# EAGLE design lyre_v1 (EAGLE 9.6.2)
CNAME: Parrot Teensy Board; CREVISION: 1.0; DESIGNER: Nathan Villicana-Shaw
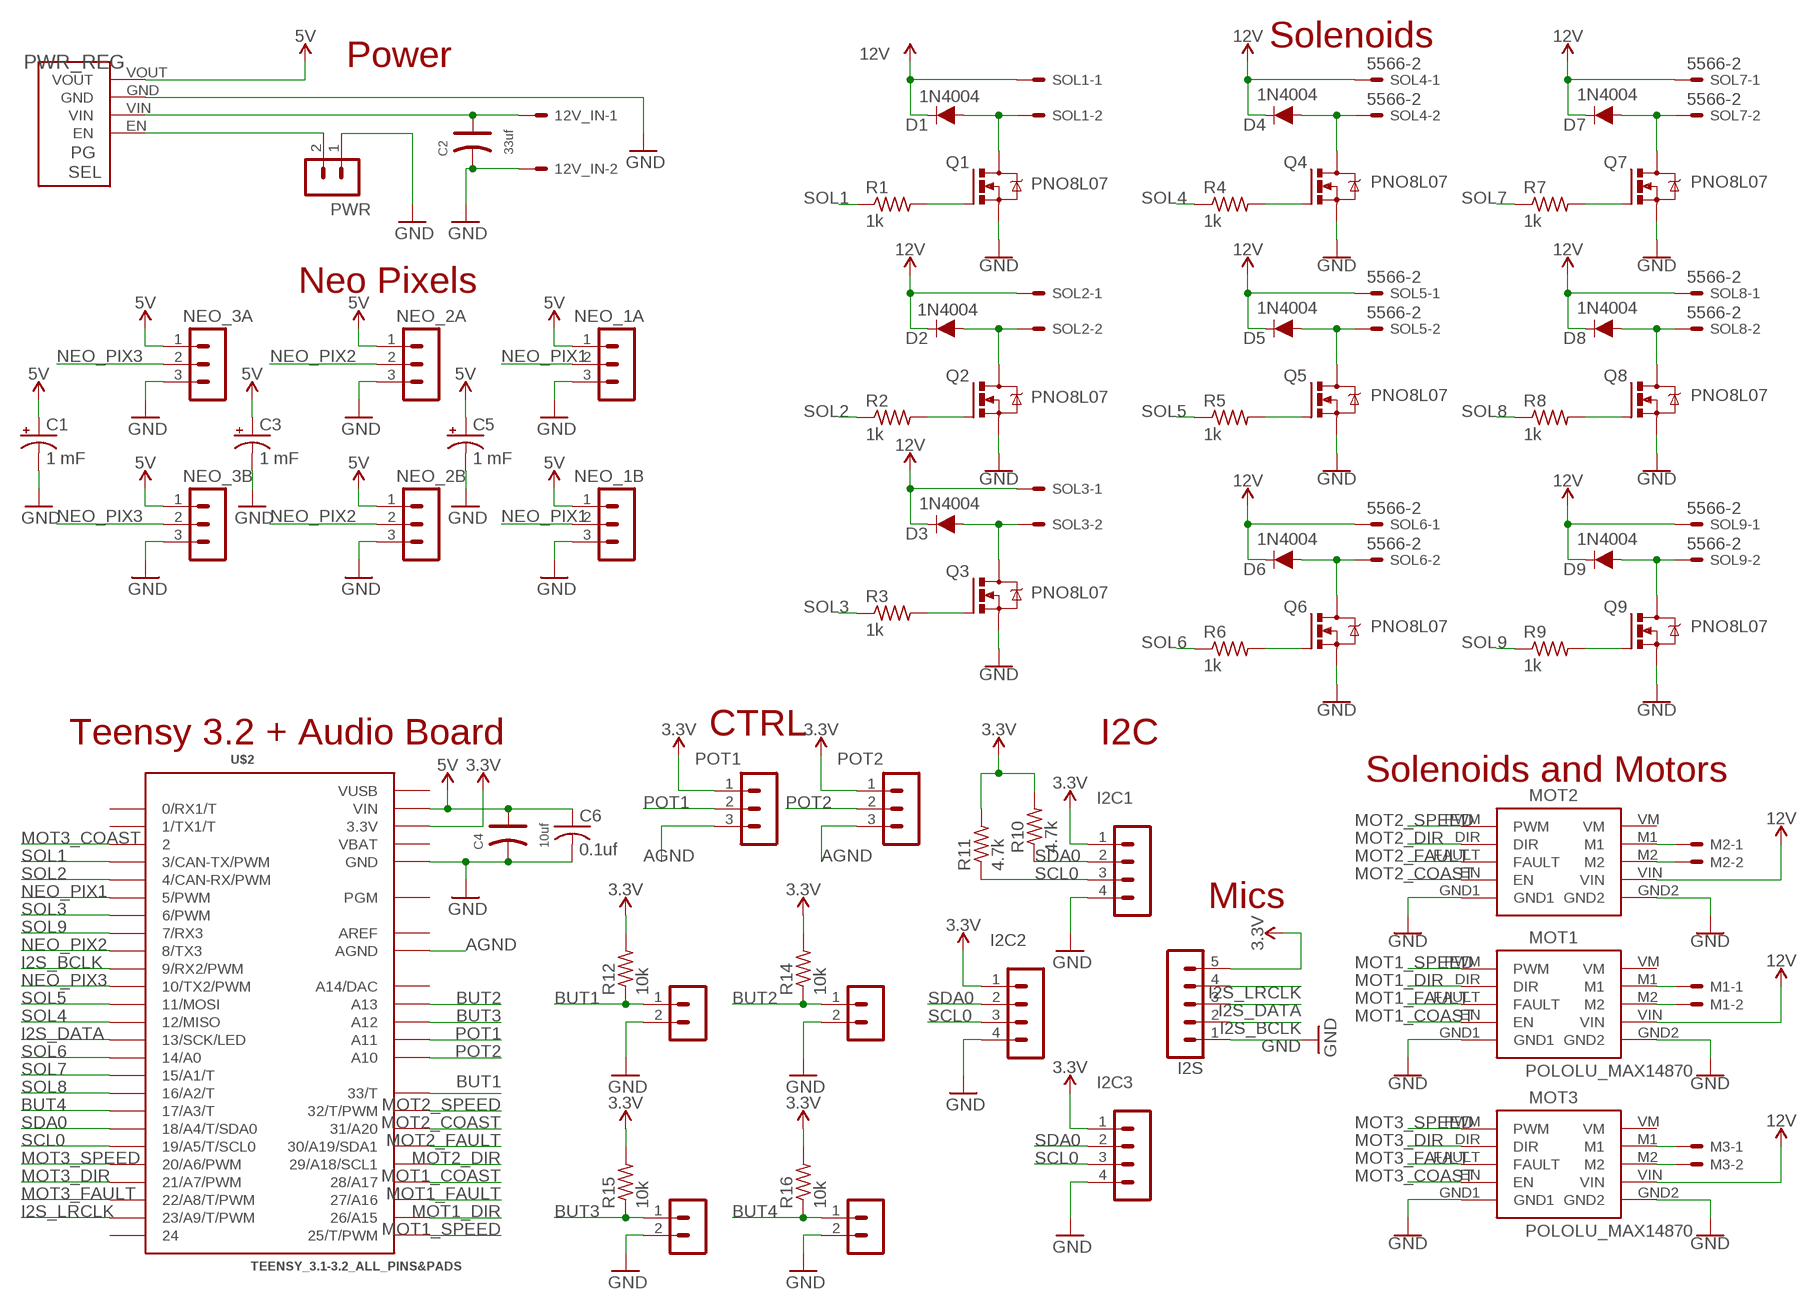
[diagram p0: schematic, sheet 1]

## Parts
12V_IN  5566-2  [5566-2]
BUT1  B2B-PH-K  [B2B-PH-K]
BUT2  B2B-PH-K  [B2B-PH-K]
BUT3  B2B-PH-K  [B2B-PH-K]
BUT4  B2B-PH-K  [B2B-PH-K]
C1  1 mF  CPOL-USUD-10X10  [UD-10X10_NICHICON]
C2  33uf  DIP-ALUMINUM-47UF-16V(D5-H7MM)  [PC-D5.3MM]
C3  1 mF  CPOL-USUD-10X10  [UD-10X10_NICHICON]
C4  10uf  DIP-ALUMINUM-47UF-16V(D5-H7MM)  [PC-D5.3MM]
C5  1 mF  CPOL-USUD-10X10  [UD-10X10_NICHICON]
C6  0.1uf  C-USC2012  [C2012]
D1  1N4004  [DIOAD1138W86L465D235B]
D2  1N4004  [DIOAD1138W86L465D235B]
D3  1N4004  [DIOAD1138W86L465D235B]
D4  1N4004  [DIOAD1138W86L465D235B]
D5  1N4004  [DIOAD1138W86L465D235B]
D6  1N4004  [DIOAD1138W86L465D235B]
D7  1N4004  [DIOAD1138W86L465D235B]
D8  1N4004  [DIOAD1138W86L465D235B]
D9  1N4004  [DIOAD1138W86L465D235B]
I2C1  B4B-PH-K  [B4B-PH-K]
I2C2  B4B-PH-K  [B4B-PH-K]
I2C3  B4B-PH-K  [B4B-PH-K]
I2S  B5B-PH-K  [B5B-PH-K]
M1  5566-2  [5566-2]
M2  5566-2  [5566-2]
M3  5566-2  [5566-2]
MOT1  POLOLU_MAX14870  [POLOLU_MAX14870]
MOT2  POLOLU_MAX14870  [POLOLU_MAX14870]
MOT3  POLOLU_MAX14870  [POLOLU_MAX14870]
NEO_1A  B3B-PH-K  [B3B-PH-K]
NEO_1B  B3B-PH-K  [B3B-PH-K]
NEO_2A  B3B-PH-K  [B3B-PH-K]
NEO_2B  B3B-PH-K  [B3B-PH-K]
NEO_3A  B3B-PH-K  [B3B-PH-K]
NEO_3B  B3B-PH-K  [B3B-PH-K]
POT1  B3B-PH-K  [B3B-PH-K]
POT2  B3B-PH-K  [B3B-PH-K]
PWR  B2B-PH-K  [B2B-PH-K]
PWR_REG  S9V11F5S6CMA_MISSINIG_PINS  [S9V11F3S5CMA_MISSING_PINS]
Q1  PNO8L07  IRF540  [TO220BV]
Q2  PNO8L07  IRF540  [TO220BV]
Q3  PNO8L07  IRF540  [TO220BV]
Q4  PNO8L07  IRF540  [TO220BV]
Q5  PNO8L07  IRF540  [TO220BV]
Q6  PNO8L07  IRF540  [TO220BV]
Q7  PNO8L07  IRF540  [TO220BV]
Q8  PNO8L07  IRF540  [TO220BV]
Q9  PNO8L07  IRF540  [TO220BV]
R1  1k  R-US_R0805  [R0805]
R2  1k  R-US_R0805  [R0805]
R3  1k  R-US_R0805  [R0805]
R4  1k  R-US_R0805  [R0805]
R5  1k  R-US_R0805  [R0805]
R6  1k  R-US_R0805  [R0805]
R7  1k  R-US_R0805  [R0805]
R8  1k  R-US_R0805  [R0805]
R9  1k  R-US_R0805  [R0805]
R10  4.7k  R-US_R0805  [R0805]
R11  4.7k  R-US_R0805  [R0805]
R12  10k  R-US_R0805  [R0805]
R14  10k  R-US_R0805  [R0805]
R15  10k  R-US_R0805  [R0805]
R16  10k  R-US_R0805  [R0805]
SOL1  5566-2  [5566-2]
SOL2  5566-2  [5566-2]
SOL3  5566-2  [5566-2]
SOL4  5566-2  [5566-2]
SOL5  5566-2  [5566-2]
SOL6  5566-2  [5566-2]
SOL7  5566-2  [5566-2]
SOL8  5566-2  [5566-2]
SOL9  5566-2  [5566-2]
U$2  TEENSY_3.1-3.2_ALL_PINS&PADS  [TEENSY_3.0-3.2_ALL_PINS_&_PADS]

## Nets
3.3V [3.3V]: I2C1.1 I2C2.1 I2C3.1 I2S.5 POT1.1 POT2.1 R10.2 R11.2 R12.2 R14.2 R15.2 R16.2 U$2.3.3V U$2.3.3V1(3.3V) U$2.3.3V2(3.3V)
5V: C1.+ C3.+ C4.+ C5.+ C6.1 NEO_1A.1 NEO_1B.1 NEO_2A.1 NEO_2B.1 NEO_3A.1 NEO_3B.1 PWR_REG.VOUT U$2.VIN
12V [12V_IN]: 12V_IN.1 C2.+ D1.2(C) D2.2(C) D3.2(C) D4.2(C) D5.2(C) D6.2(C) D7.2(C) D8.2(C) D9.2(C) MOT1.VIN MOT2.VIN MOT3.VIN PWR_REG.VIN SOL1.1 SOL2.1 SOL3.1 SOL4.1 SOL5.1 SOL6.1 SOL7.1 SOL8.1 SOL9.1
AGND: POT1.3 POT2.3 U$2.AGND
BUT1: BUT1.1 R12.1 U$2.33(33/T)
BUT2: BUT2.1 R14.1 U$2.A13
BUT3: BUT3.1 R15.1 U$2.A12
BUT4: BUT4.1 R16.1 U$2.17/A3(17/A3/T)
GND: 12V_IN.2 BUT1.2 BUT2.2 BUT3.2 BUT4.2 C1.- C2.- C3.- C4.- C5.- C6.2 I2C1.4 I2C2.4 I2C3.4 I2S.1 MOT1.GND1 MOT1.GND2 MOT2.GND1 MOT2.GND2 MOT3.GND1 MOT3.GND2 NEO_1A.3 NEO_1B.3 NEO_2A.3 NEO_2B.3 NEO_3A.3 NEO_3B.3 PWR.1 PWR_REG.GND Q1.S Q2.S Q3.S Q4.S Q5.S Q6.S Q7.S Q8.S Q9.S U$2.GND U$2.GND1(GND) U$2.GND2(GND)
I2S_BCLK: I2S.2 U$2.9(9/RX2/PWM)
I2S_DATA: I2S.3 U$2.13(13/SCK/LED)
I2S_LRCLK: I2S.4 U$2.23/A9(23/A9/T/PWM)
MOT1_COAST: MOT1.EN U$2.28(28/A17)
MOT1_DIR: MOT1.DIR U$2.26(26/A15)
MOT1_FAULT: MOT1.FAULT U$2.27(27/A16)
MOT1_SPEED: MOT1.PWM U$2.25(25/T/PWM)
MOT2_COAST: MOT2.EN U$2.31(31/A20)
MOT2_DIR: MOT2.DIR U$2.29(29/A18/SCL1)
MOT2_FAULT: MOT2.FAULT U$2.30(30/A19/SDA1)
MOT2_SPEED: MOT2.PWM U$2.32(32/T/PWM)
MOT3_COAST: MOT3.EN U$2.2
MOT3_DIR: MOT3.DIR U$2.21/A7(21/A7/PWM)
MOT3_FAULT: MOT3.FAULT U$2.22/A8(22/A8/T/PWM)
MOT3_SPEED: MOT3.PWM U$2.20/A6(20/A6/PWM)
N$1: Q5.G R5.2
N$2: D5.1(A) Q5.D SOL5.2
N$3: M1.2 MOT1.M2
N$4: Q6.G R6.2
N$5: Q2.G R2.2
N$6: D6.1(A) Q6.D SOL6.2
N$8: D2.1(A) Q2.D SOL2.2
N$9: M1.1 MOT1.M1
N$10: PWR.2 PWR_REG.EN
N$11: Q3.G R3.2
N$12: D3.1(A) Q3.D SOL3.2
N$13: Q4.G R4.2
N$14: D4.1(A) Q4.D SOL4.2
N$15: M3.2 MOT3.M2
N$16: M3.1 MOT3.M1
N$17: Q7.G R7.2
N$18: D7.1(A) Q7.D SOL7.2
N$19: Q8.G R8.2
N$20: D8.1(A) Q8.D SOL8.2
N$21: Q9.G R9.2
N$22: D9.1(A) Q9.D SOL9.2
N$24: Q1.G R1.2
N$25: D1.1(A) Q1.D SOL1.2
N$30: M2.2 MOT2.M2
N$31: M2.1 MOT2.M1
NEO_PIX1: NEO_1A.2 NEO_1B.2 U$2.5(5/PWM)
NEO_PIX2: NEO_2A.2 NEO_2B.2 U$2.8(8/TX3)
NEO_PIX3: NEO_3A.2 NEO_3B.2 U$2.10(10/TX2/PWM)
POT1: POT1.2 U$2.A11
POT2: POT2.2 U$2.A10
SCL0: I2C1.3 I2C2.3 I2C3.3 R11.1 U$2.19/A5(19/A5/T/SCL0)
SDA0: I2C1.2 I2C2.2 I2C3.2 R10.1 U$2.18/A4(18/A4/T/SDA0)
SOL1: R1.1 U$2.3(3/CAN-TX/PWM)
SOL2: R2.1 U$2.4(4/CAN-RX/PWM)
SOL3: R3.1 U$2.6(6/PWM)
SOL4: R4.1 U$2.12(12/MISO)
SOL5: R5.1 U$2.11(11/MOSI)
SOL6: R6.1 U$2.14/A0
SOL7: R7.1 U$2.15/A1(15/A1/T)
SOL8: R8.1 U$2.16/A2(16/A2/T)
SOL9: R9.1 U$2.7(7/RX3)
Unconnected: MOT1.VM MOT2.VM MOT3.VM U$2.0(0/RX1/T) U$2.1(1/TX1/T) U$2.24 U$2.PGM U$2.RESET/DAC(A14/DAC)

## Notes on the sheet
- Solenoids
- Power
- Neo Pixels
- Teensy 3.2 + Audio Board | CTRL | I2C
- Solenoids and Motors
- Mics

## Power pins joined to a net without a drawn wire
AREF: U$2.AREF
VBAT: U$2.VBAT
VUSB: U$2.VUSB

## Library data of the parts
12V_IN M1-M3 SOL1-SOL9 = con-molex:5566-2: Mini FIT connector 2 pol Source: http://www.molex.com; MF: MOLEX; OC_FARNELL: 1822072; OC_NEWARK: unknown
BUT1-BUT4 PWR = con-jst-ph:B2B-PH-K: HEADER
C1 C3 C5 = rcl:CPOL-US: POLARIZED CAPACITOR, American symbol; SPICEPREFIX: C
C2 C4 = Seeed-Capacitor:DIP-ALUMINUM-47UF-16V(D5-H7MM): 302030033; MPN: KS 100uF/16V; VALUE: 100uf
C6 = adafruit:C-US: CAPACITOR, American symbol
D1-D9 = nathans-custom-parts:1N4004
I2C1-I2C3 = con-jst-ph:B4B-PH-K: HEADER
I2S = con-jst-ph:B5B-PH-K: HEADER
MOT1-MOT3 = nathans-custom-parts:POLOLU_MAX14870
NEO_1A NEO_1B NEO_2A NEO_2B NEO_3A NEO_3B POT1 POT2 = con-jst-ph:B3B-PH-K: HEADER
PWR_REG = nathans-custom-parts:S9V11F5S6CMA_MISSINIG_PINS
Q1-Q9 = nathans-custom-parts:IRF540: HEXFET Power MOSFET
R1-R12 R14-R16 = rcl:R-US_: RESISTOR, American symbol; SPICEPREFIX: R
U$2 = teensy_3_and_LC:TEENSY_3.1-3.2_ALL_PINS&PADS: Footprint for Teensy 3.1 or 3.2 board using all pads and all through-holes. Pads need a 2x7 0.1" SMD header.

## Net classes
0 default: width 0.203 mm, drill 0.203 mm, clearance 0.152 mm
1 12V_IN: width 1.016 mm, drill 0.381 mm, clearance 0.203 mm
2 3.3V: width 0.305 mm, drill 0.305 mm, clearance 0.203 mm
3 5V: width 0.787 mm, drill 0.305 mm, clearance 0.203 mm

## Board
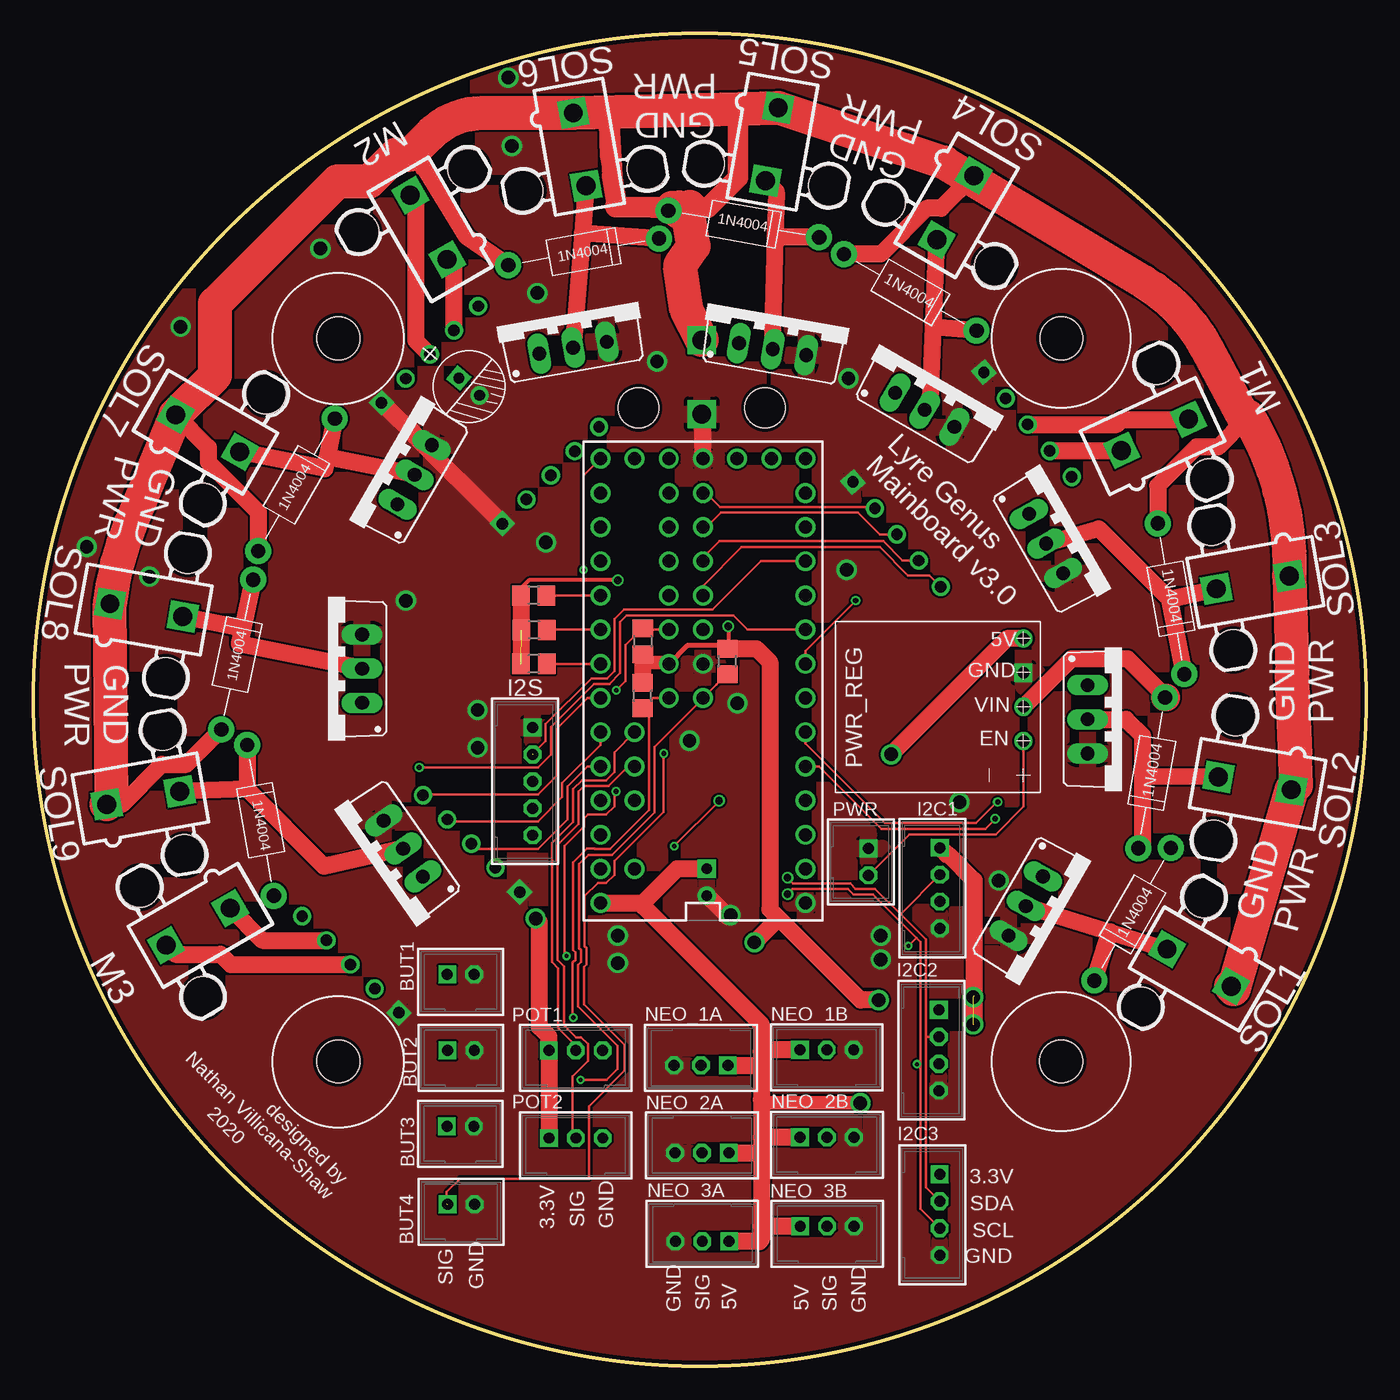
[diagram p1: board, top side]
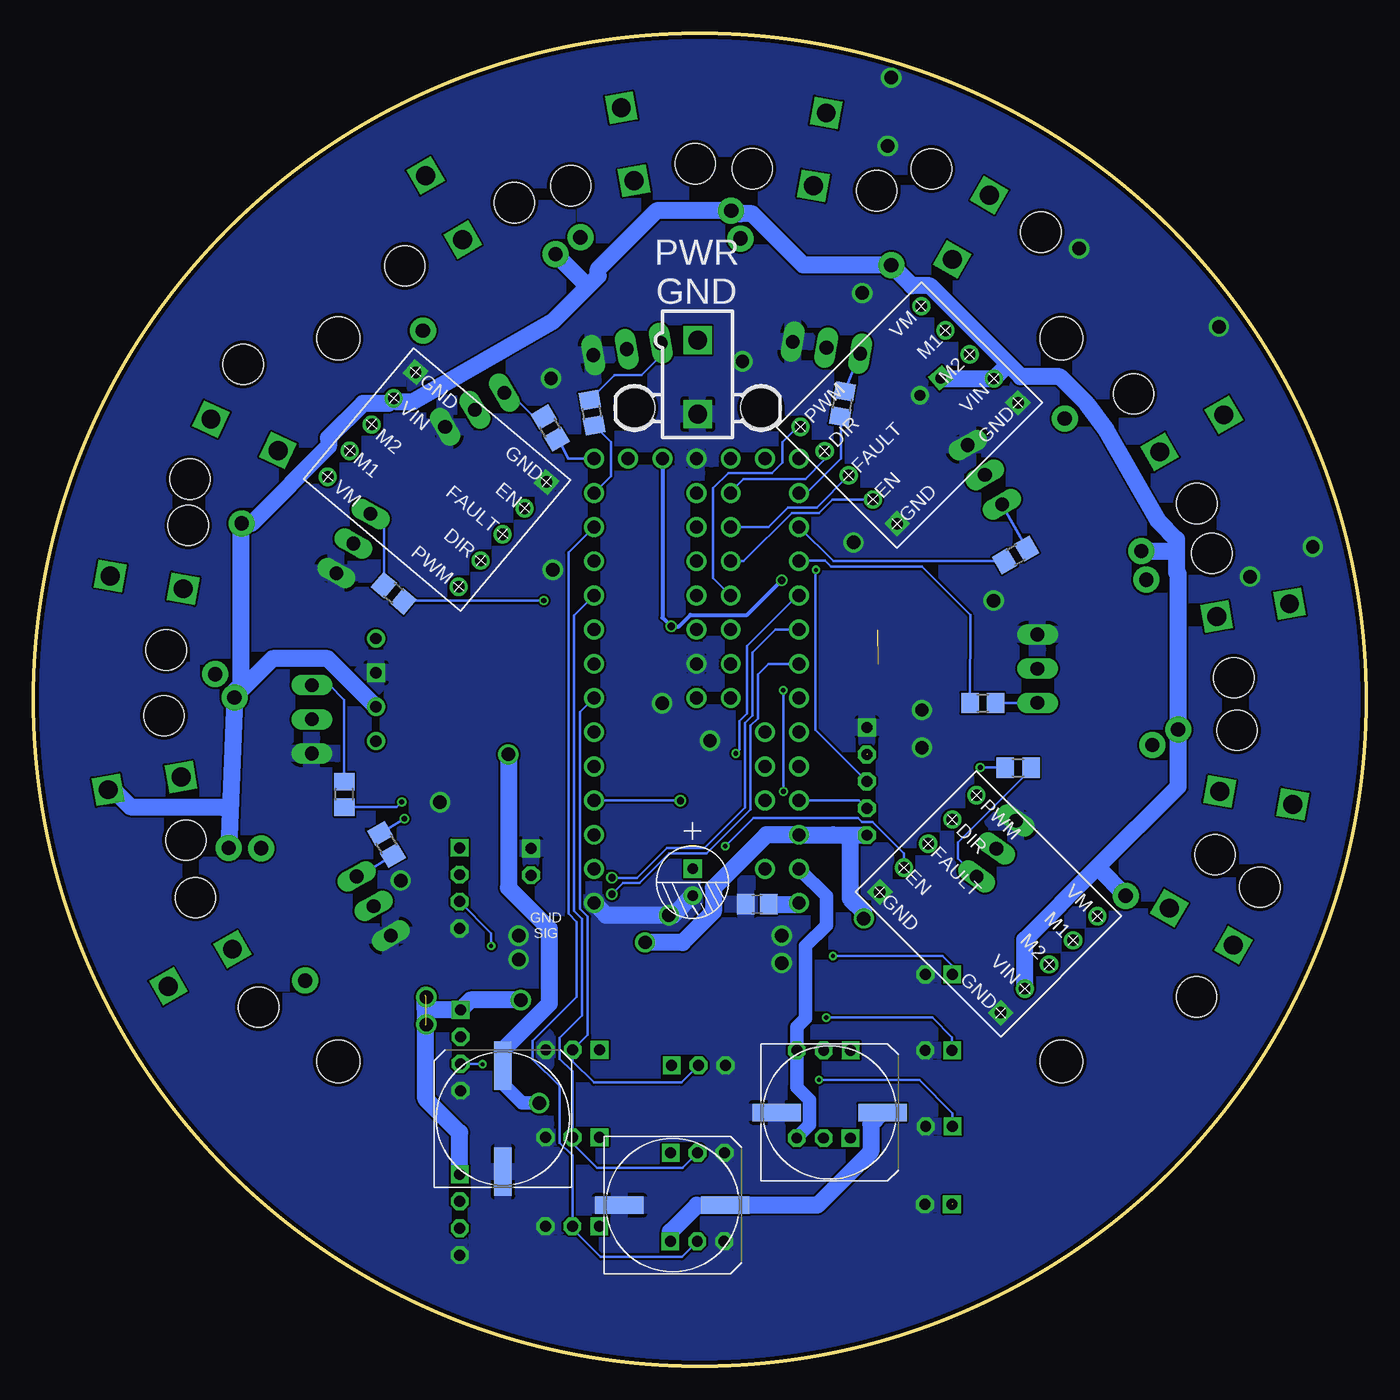
[diagram p2: board, bottom side, seen from below]

Size 99 x 99 mm. Coordinates in mm from the lower left corner, seen from the top.
Outline: circle at 49.5,49.5 radius 49.5
Copper layers (1*16): Top 0.035mm / dielectric 1.5mm / Bottom 0.035mm
Design rules "SeeedStudio_2layer_DRU_no_angle_20140221": minimum track width 6mil, minimum drill 12mil, track to track 6mil, track to pad 6mil, pad to pad 6mil, via to via 6mil, smd to smd 0mil, copper to edge 10mil, drill to drill 10mil, minimum pad ring 10mil, minimum via ring 6mil, stop-mask expansion 2mil, vias tented up to drill 100mil, thermal gap 10mil
Holes 3.2 mm at 76.36,22.63 22.63,76.37 22.63,22.63 76.37,76.37

### Footprints (pad centres in the part's own frame; a part is rotated, then mirrored left to right if it is on the bottom)
5566-2 = drill 1.4 square: 1 0,-2.75; 2 0,2.75 | hole 3: 4.7,2.29; -4.7,2.29
B2B-PH-K = drill 0.813 square: 1 -1,0 | drill 0.813 octagon: 2 1,0
UD-10X10_NICHICON = smd 3.6 x 1.3: + 3.925,0; - -3.95,0
PC-D5.3MM = drill 0.8 pad 1.35 square: + -1,0 | drill 0.8 pad 1.35: - 1,0
C2012 = smd 1.3 x 1.5: 1 -0.85,0; 2 0.85,0
DIOAD1138W86L465D235B = drill 1.06 pad 1.93: 1 -5.69,0; 2 5.69,0
B4B-PH-K = drill 0.813 square: 1 -3,0 | drill 0.813 octagon: 2 -1,0; 3 1,0; 4 3,0
B5B-PH-K = drill 0.813 square: 1 -4,0 | drill 0.813 octagon: 2 -2,0; 3 0,0; 4 2,0; 5 4,0
POLOLU_MAX14870 = drill 0.85: DIR -6.35,2.54; EN -6.35,-2.54; FAULT -6.35,0; M1 6.35,2.54; M2 6.35,0; PWM -6.35,5.08; VIN 6.35,-2.54; VM 6.35,5.08 | drill 0.85 square: GND1 -6.35,-5.08; GND2 6.35,-5.08
B3B-PH-K = drill 0.813 square: 1 -2,0 | drill 0.813 octagon: 2 0,0; 3 2,0
S9V11F3S5CMA_MISSING_PINS = drill 0.85: EN 0,0; VIN 2.54,0; VOUT 7.62,0 | drill 0.85 square: GND 5.08,0
TO220BV = drill 1.016 long: D 0,-2.54; G -2.54,-2.54; S 2.54,-2.54
R0805 = smd 1.3 x 1.5: 1 -0.95,0; 2 0.95,0
TEENSY_3.0-3.2_ALL_PINS_&_PADS = drill 0.965: 0 -7.62,13.97; 1 -7.62,11.43; 2 -7.62,8.89; 3 -7.62,6.35; 3.3V 7.62,11.43; 3.3V1 -2.54,-16.51; 3.3V2 2.54,-1.27; 4 -7.62,3.81; 5 -7.62,1.27; 6 -7.62,-1.27; 7 -7.62,-3.81; 8 -7.62,-6.35; 9 -7.62,-8.89; 10 -7.62,-11.43; 11 -7.62,-13.97; 12 -7.62,-16.51; 13 7.62,-16.51; 14/A0 7.62,-13.97; 15/A1 7.62,-11.43; 16/A2 7.62,-8.89; 17/A3 7.62,-6.35; 18/A4 7.62,-3.81; 19/A5 7.62,-1.27; 20/A6 7.62,1.27; 21/A7 7.62,3.81; 22/A8 7.62,6.35; 23/A9 7.62,8.89; 24 0,-3.81; 25 0,-6.35; 26 0,-8.89; 27 0,-11.43; 28 0,-13.97; 29 2.54,-13.97; 30 2.54,-11.43; 31 2.54,-8.89; 32 2.54,-6.35; 33 2.54,-3.81; A10 5.08,6.35; A11 5.08,3.81; A12 0,1.27; A13 2.54,1.27; AGND 7.62,13.97; AREF 5.08,8.89; GND -7.62,16.51; GND1 0,-16.51; GND2 0,-1.27; PGM 2.54,-16.51; RESET/DAC 5.08,-16.51; VBAT -5.08,-16.51; VIN 7.62,16.51; VUSB 5.08,13.97

### Placement (x,y rotation side)
12V_IN  49.65,73.47 180 bottom
BUT1  31.74,29.09 0 top
BUT2  31.75,23.44 0 top
BUT3  31.71,17.8 0 top
BUT4  31.76,11.99 0 top
C1  39.84,18.83 0 bottom
C2  32.36,72.77 320 top
C3  51.52,11.94 0 bottom
C4  50.02,35.94 270 bottom
C5  64.13,18.38 90 bottom
C6  45.23,34.31 180 bottom
D1  81.67,33.55 60 top
D2  83.09,44.07 80 top
D3  84.52,57.01 100 top
D4  65.15,79.77 150 top
D5  52.77,84.85 170 top
D6  40.87,82.79 190 top
D7  19.54,65.47 240 top
D8  15.13,52.85 258 top
D9  16.86,40.54 280 top
I2C1  67.35,35.5 270 top
I2C2  67.28,23.45 270 top
I2C3  67.33,11.23 270 top
I2S  37.08,43.44 270 top
M1  83.33,69.19 295 top
M2  29.36,84.61 30 top
M3  12.22,32.64 120 top
MOT1  69.02,65.87 140 bottom
MOT2  33.93,70.67 45 bottom
MOT3  28.04,34.32 315 bottom
NEO_1A  49.58,22.33 180 top
NEO_1B  58.94,23.48 0 top
NEO_2A  49.66,15.83 180 top
NEO_2B  58.95,16.98 0 top
NEO_3A  49.69,9.25 180 top
NEO_3B  58.97,10.37 0 top
POT1  40.29,23.44 0 top
POT2  40.29,16.92 0 top
PWR  62.04,37.45 270 top
PWR_REG  73.56,46.43 90 top
Q1  75.93,32.9 240 top
Q2  80.87,48.05 270 top
Q3  77.44,62.38 300 top
Q4  67.49,73.25 330 top
Q5  55.35,78.06 350 top
Q6  39.65,78.17 10 top
Q7  26.11,67.49 60 top
Q8  21.87,51.81 90 top
Q9  25.38,36.98 125 top
R1  72.78,38.75 300 bottom
R2  75.91,42.47 90 bottom
R3  72.24,57.41 140 bottom
R4  60.6,69.69 120 bottom
R5  57.51,70.84 100 bottom
R6  38.9,71.48 80 bottom
R7  26.03,60.27 30 bottom
R8  28.47,49.25 0 bottom
R9  25.84,44.45 0 bottom
R10  37.2,54.69 180 top
R11  37.17,52.17 180 top
R12  45.26,53.84 270 top
R14  45.26,49.81 90 top
R15  51.55,52.34 90 top
R16  37.16,57.25 180 top
SOL1  86.61,29.59 60 top
SOL2  90.75,43.29 80 top
SOL3  90.59,58.22 100 top
SOL4  68.49,86.07 150 top
SOL5  54.86,90.78 170 top
SOL6  40.58,90.4 190 top
SOL7  12.94,69.3 240 top
SOL8  8.38,56.16 260 top
SOL9  8.14,42.21 280 top
U$2  49.74,50.9 180 top

### Tracks (layer width: path | path; a pad name or v marks a point on that pad's centre or on a via)
3.3V  (via drill 0.55, 1)  (5 unrouted)
  Top 0.305: v51.63,54.95 51.63,53.37 R15.2 | R16.2 36.21,57.8 36.8,58.39 v43.4,58.39
  Top 0.381: R15.2 51.32,53.53 48.56,53.53 U$2.3.3V2
  Top 1.016: U$2.3.3V2 47.1,52.27 45.26,52.27 R12.2
  Top 1.27: R16.2 36.21,52.19 R11.2 | R14.2 | R12.2 R14.2 | R15.2 53.71,53.29 54.7,52.3 54.7,33.94 55.24,33.4 | I2C1.1 67.85,38 67.97,38 69.89,36.09 69.89,25.34 | v62.8,27.18 61.46,27.18 55.24,33.4 | v53.56,31.47 55.24,33.14 55.24,33.4 | POT2.1 POT1.1 38.29,24.47 37.58,25.17 37.58,32.97 v37.31,33.24
  Bottom 0.305: U$2.3.3V1 52.28,55.6 v51.63,54.95 51.05,54.95 50.19,55.8 45.99,55.8 v43.4,58.39
  Bottom 1.27: 38.32,39.44 39.59,39.45 U$2.3.3V 44.54,39.47 48.48,35.53 48.48,33.75 50.77,31.47 v53.56,31.47 | 38.32,39.44 I2S.5 | I2C3.1 67.33,17.33 69.86,19.86 69.86,26.46 | 69.91,27.54 69.91,26.46 69.86,26.46 | 69.86,26.46 67.29,26.46 I2C2.1 66.55,27.18 v62.8,27.18 | 38.32,39.44 38.32,34.75 37.31,33.73 v37.31,33.24
  other vias: 69.82,27.4 69.82,25.37
5V  (via drill 1)
  Top 1.016: v61.44,19.53 54.33,19.53 54.07,19.78
  Top 1.27: U$2.VIN 45.28,34.39 | 45.28,34.39 47.84,36.95 50.01,36.95 C4.+ | 45.28,34.39 45.28,34.16 54.07,25.37 54.07,23.34 | 54.07,23.34 54.07,22.32 | 54.07,22.32 54.07,19.78 54.07,16.99 | 54.07,16.99 54.07,15.72 | 54.07,15.72 54.07,10.38 | 54.07,10.38 54.07,9.37 53.95,9.25 NEO_3A.1 | NEO_2A.1 53.96,15.83 54.07,15.72 | NEO_1A.1 54.07,22.32 | NEO_1B.1 54.22,23.48 54.07,23.34 | NEO_2B.1 54.08,16.98 54.07,16.99 | NEO_3B.1 54.09,10.37 54.07,10.38 | PWR_REG.VOUT 72.34,54.05 v63.72,45.44
  Bottom 1.016: C5.+ 64.13,20.95 62.71,19.53 v61.44,19.53
  Bottom 1.27: C6.1 42.2,34.31 U$2.VIN | v63.72,45.44 63.72,35.53 60.69,32.5 60.69,26.91 64.13,23.46 C5.+ | NEO_3A.1 51.69,9.98 49.72,11.94 C3.+ 40.77,11.94 36.8,15.92 36.8,17.95 C1.+
12V
  Top 1.27: SOL5.1 SOL4.1 67.44,86.02 66.36,86.02 62.95,82.61 D4.2 | 93.54,51.5 93.49,51.5 | 84.05,49.48 84.05,49.65 D2.2 | 90.28,70.54 90.02,70.27 88.03,68.29 86.41,68.29 83.53,65.41 D3.2 | 28.03,90.04 28.92,89.15 28.84,89.17 29.12,88.88 32.16,83.92 D6.2 | SOL7.1 12.98,68.25 12.98,67.17 16.69,63.46 D7.2 | D8.2 11.35,44.69 9.53,44.69 6.57,41.73 SOL9.1 | D5.2 46.94,85.84 43.24,86.11 | 43,88.38 42.97,88.44 42.73,89.8 42.64,92.43 | 42.8,92.38 42.64,92.43 | 42.64,92.43 SOL6.1 | PWR_REG.VIN 74.58,49.99 77.14,52.55 81.29,52.55 84.17,49.67
  Top 1.524: D5.2 47.35,85.65 47.49,85.65 48.52,84.62 48.52,78.46 | 48.75,86.11 43.24,86.11 43.28,86.68 42.97,88.44 | 43,88.38 42.8,92.38 | 47.98,86.08 50.12,86.08 52.35,88.3 52.35,93.21 52.55,93.42 | 93.38,45.39 93.75,45.39
  Top 2.032: D2.2 84.17,49.67
  Top 2.54: SOL9.1 5.79,42.09 SOL8.1 arc-17 7.17,62.53 SOL7.1 13.48,73.6 13.48,78.94 22.57,88.03 24.96,88.03 26.94,90.01 28,90.01 28.03,90.04 29.51,91.53 arc-45 33.33,93.11 SOL6.1 52.55,93.42 SOL5.1 67.69,89.42 82.47,80.56 arc-31 87.16,75.62 90.02,70.27 | 90.28,70.54 90.77,69.62 arc-30 SOL3.1 93.54,51.5 | SOL1.1 89.15,27.99 SOL2.1 93.82,43.17 93.49,51.5 93.75,45.39 | 12V_IN.1 48.52,78.46 48.04,81.77 49.05,83.21 48.7,85.2 47.48,86.06 47.98,86.08 48.75,86.11
  Bottom 1.27: MOT3.VIN 25.34,31.66 19.98,37.02 | 19.98,37.02 19.93,37.02 D9.2 | 19.98,37.02 13.95,43.05 D8.2 13.95,58.85 14.07,58.98 14.07,60.42 | 26.57,74.43 25.64,73.5 22.74,73.5 20.71,71.47 19.31,69.6 15.38,62.73 14.07,61.42 14.07,60.42 | 26.57,74.43 32.41,80.27 33.73,80.27 D6.2 41.8,81.8 45.61,85.62 46.5,85.62 D5.2 52.7,85.84 57.05,81.5 57.05,81 57.72,80.32 | D4.2 60.22,82.56 | D4.2 60.35,82.48 | D2.2 84.07,50.14 83.6,50.61 83.6,62.54 D3.2 82.81,62.61 77.08,68.34 77.08,68.97 74.53,71.52 72.62,71.52 MOT1.VIN 71.99,71.64 70.83,71.64 60.35,77.69 57.72,80.32 | D2.2 84.41,41.12 | 84.41,41.12 D1.2 | 26.57,74.43 MOT2.VIN 31.57,73.36 C2.+ | SOL2.1 93.06,42.81 91.79,41.54 84.83,41.54 84.41,41.12 | PWR_REG.VIN 74.58,49.99 77.14,52.55 81.25,52.55 84.07,49.72 D2.2 | D4.2 57.93,80.32 57.72,80.32 | D7.2 14.2,60.54 14.07,60.42
AGND
  Bottom 1.016: POT2.3 42.3,16.95 41.33,17.91 41.33,19.76 42.29,20.71 POT1.3 42.29,25.17 41.63,25.83 41.63,31.21 40.1,32.74 40.1,34.91 U$2.AGND
BUT1  (via drill 0.3, 0.35)
  Top 0.203: U$2.33 45.34,54.71 R12.1 45.24,54.81 43.98,53.55 43.98,50.89 v43.3,50.21 | v43.28,42.69 43.25,42.72 43.16,42.63 43.16,41.58 42.55,40.97 41.2,40.97 40.91,40.68 40.91,40.09 39.46,38.65 39.46,30.58 v39.59,30.45
  Bottom 0.203: v43.28,42.69 43.28,50.01 43.29,50.02 v43.3,50.21 | v39.59,30.45 31.47,30.45 30.74,29.72 BUT1.1
BUT2  (via drill 0.3)
  Top 0.203: U$2.A13 46.03,49.63 R14.1 45.34,48.86 45.72,48.48 45.72,41.31 42.84,38.43 41.69,38.43 41.68,38.43 41.11,38.43 40.08,37.4 40.08,30.9 40.26,30.72 40.26,30.18 40.05,29.97 40.05,25.93 v40.1,25.88
  Bottom 0.203: v40.1,25.88 32.23,25.88 30.75,24.4 BUT2.1
BUT3  (via drill 0.3)
  Top 0.203: R15.1 50.73,50.62 U$2.A12 49.74,49.6 46.12,45.99 46.12,41.11 42.99,37.97 41.23,37.97 40.54,37.28 40.54,31.02 40.66,30.89 40.66,30.01 40.46,29.8 40.46,26.73 43.4,23.78 43.4,22.07 42.59,21.25 v40.64,21.25
  Bottom 0.203: v40.64,21.25 33.19,21.25 30.71,18.77 BUT3.1
BUT4  (via drill 0.35)  (1 unrouted)
  Top 0.203: U$2.17/A3 R16.1 | v46.82,45.51 v46.81,45.5 46.81,41.18 43.16,37.53 43.16,36.5 42.55,35.89 41.94,35.89 40.95,34.9 40.95,31.18 41.07,31.06 41.07,29.84 40.89,29.66 40.89,26.86 43.91,23.85 43.91,21.94 41.26,19.29 41.26,13.92 41.27,13.91 31.69,13.91 30.7,12.92 30.7,12.05
  Bottom 0.203: U$2.17/A3 42.23,57.25 45.99,53.49 45.99,48.48 46.54,47.94 46.54,45.79 v46.82,45.51
GND  (via drill 1)
  Top 1.27: U$2.GND1 49.74,70.63 12V_IN.2 | 28.25,69.32 29.4,68.24 Q7.S | 28.25,69.32 28.21,69.36 27.76,69.78 MOT2.GND2 | 51.59,33.38 C4.- | MOT2.GND1 28.25,69.16 28.25,69.32
  Bottom 1.27: U$2.GND 56.47,33.5 v51.79,33.5 51.47,33.5 C4.-
  other vias: 32.99,48.74 32.99,45.94 48.74,46.45 52.29,49.25 43.4,31.97 43.4,29.94 71.72,36.07 68.8,41.88 60.42,59.15 60.55,73.38 46.33,74.65 37.44,79.73 38.07,61.18 27.66,56.87 62.96,31.97 62.96,30.2 35.53,90.65 35.28,95.73 21.31,83.03 10.92,77.22 8.61,58.65 3.95,60.86
  pour Bottom: 99.41,48.45 99.41,49.02 arc90 48.9,99.54 47.71,99.54 arc90 -0.41,51.42 -0.41,50.21 arc90 49.96,-0.16 50.8,-0.16 arc90
  pour Top: 99.54,48.46 99.54,48.72 arc90 48.59,99.66 arc90 -0.16,50.92 arc90 50.92,-0.16 arc90
I2S_BCLK  (1 unrouted)
  Top 0.203: U$2.9 54.06,59.79 50.46,56.2 43.88,56.2 43.16,55.48 43.16,51.64 42.62,51.1 41.44,51.1 38.05,47.7 38.05,46.45 37.08,45.48
I2S_DATA  (via drill 0.3)
  Top 0.203: v40.86,59.15 40.86,66.16 U$2.13
  Bottom 0.203: I2S.3 40.89,47.24 40.89,59.13 v40.86,59.15
I2S_LRCLK
  Bottom 0.203: U$2.23/A9 37.66,42.01 I2S.4
MOT1_COAST
  Top 0.203: U$2.28 49.97,64.87 51.01,63.83 62.43,63.83 MOT1.EN
MOT1_DIR
  Top 0.203: U$2.26 49.74,60.08 50.95,61.29 63.13,61.29 64.58,59.84 MOT1.DIR
MOT1_FAULT
  Top 0.203: U$2.27 50.02,62.33 51.08,63.39 61.27,63.39 62.88,61.79 MOT1.FAULT
MOT1_SPEED
  Top 0.203: U$2.25 49.74,57.96 52.61,60.83 62.89,60.83 64.98,58.74 66.57,58.74 MOT1.PWM
MOT2_COAST
  Bottom 0.203: U$2.31 46.26,59.79 42.66,63.39 40.63,63.39 39.63,64.38 MOT2.EN
MOT2_DIR
  Bottom 0.203: MOT2.DIR 40.22,67.34 41.65,65.91 46.27,65.91 47.2,64.98 U$2.29
MOT2_FAULT
  Bottom 0.203: U$2.30 44.4,62.33 42.93,63.79 40.81,63.79 MOT2.FAULT
MOT2_SPEED
  Bottom 0.203: U$2.32 48.51,58.56 48.51,65.23 47.38,66.36 44.13,66.36 43.36,67.12 43.36,68.64 42.23,69.77 MOT2.PWM
MOT3_COAST  (via drill 0.35, 0.55)
  Top 0.203: v47.6,38.62 50.93,41.95 v50.93,42.01
  Bottom 0.203: MOT3.EN 34.32,38.09 36.66,40.43 37.46,40.43 37.75,40.72 45.51,40.72 v47.6,38.62 | v50.93,42.01 U$2.2
MOT3_DIR
  Top 0.203: U$2.21/A7 42.12,46.15 39.27,43.3 39.27,42.26 37.47,40.46 30.88,40.46 MOT3.DIR
MOT3_FAULT
  Top 0.203: U$2.22/A8 41.18,44.55 39.68,43.05 39.68,40.6 37.48,38.4 32.93,38.4 MOT3.FAULT
MOT3_SPEED
  Top 0.203: U$2.20/A6 41.18,49.63 38.87,47.32 38.87,43.85 37.48,42.46 29,42.46 MOT3.PWM
N$1
  Bottom 0.203: R5.2 55.81,73.63 53.82,73.63 52.41,75.04 Q5.G
N$2
  Top 1.27: Q5.D 55.12,83.86 | SOL5.2 55.19,87.26 55.1,83.86 55.12,83.86 | D5.1 55.6,83.86 55.12,83.86
N$3
  Top 1.27: MOT1.M2 80.5,69.95 80.87,70.33 85.8,70.33 M1.2
N$4
  Bottom 0.203: R6.2 Q6.G
N$5
  Bottom 0.203: R2.2 75.91,49.49 77.06,50.64 78.28,50.64 Q2.G
N$6
  Top 1.27: SOL6.2 40.78,84.19 | 40.78,84.19 Q6.D | D6.1 40.78,84.19
N$8
  Top 1.27: Q2.D 81.18,48.05 82.39,46.83 82.39,43.78 | 82.39,43.78 82.39,38.76 D2.1 | SOL2.2 82.39,43.78
N$9
  Top 1.27: MOT1.M1 75.53,68.03 M1.1
N$10
  Top 0.203: PWR.2 65.09,39.5 71.5,39.5 73.56,41.56 PWR_REG.EN
N$11
  Bottom 0.203: Q3.G 72.97,62.31 R3.2
N$12
  Top 1.27: D3.1 84.42,56.95 | Q3.D 79.15,62.22 84.42,56.95 | SOL3.2 84.42,56.95
N$13
  Bottom 0.203: Q4.G 63.62,72.31 61.55,70.24 R4.2
N$14
  Top 1.27: Q4.D 66.64,71.72 66.86,77.19 | 66.86,77.19 SOL4.2 | D4.1 66.86,77.19
N$15
  Top 1.27: MOT3.M2 14.65,29.83 13.89,30.58 10.53,30.58 M3.2
N$16
  Top 1.27: M3.1 17,31.62 MOT3.M1
N$17
  Bottom 0.203: Q7.G R7.2
N$18
  Top 1.27: Q7.D 21.81,67.52 | SOL7.2 21.64,66.66 21.81,67.52 | D7.1 21.81,67.52
N$19
  Bottom 0.203: Q8.G 27.17,49.27 R8.2
N$20
  Top 1.27: Q8.D 15.29,53.65 15.53,54.77 15.53,54.78 | 15.53,54.78 SOL8.2 | D8.1 15.53,54.78
N$21
  Bottom 0.203: R9.2 24.89,44.32 30.32,38.89 30.32,37.69 29,36.36 Q9.G
N$22
  Top 1.27: 15.85,42.86 SOL9.2 | D9.1 15.85,42.86 | Q9.D 21.59,37.12 15.85,42.86
N$24
  Bottom 0.203: Q1.G 73.75,37.03 R1.2
N$25
  Top 1.27: Q1.D 79.98,32.25 | SOL1.2 79.99,32.26 79.98,32.25 | D1.1 79.98,32.25
N$30
  Top 1.27: MOT2.M2 28.4,76.2 28.4,86.58 M2.2
N$31
  Top 1.27: MOT2.M1 31.24,81.72 M2.1
NEO_PIX1
  Bottom 0.203: NEO_1A.2 50.86,21.05 57.37,21.05 58.94,22.62 NEO_1B.2 57.83,24.59 57.83,33.38 58.4,33.96 58.4,48.59 U$2.5
NEO_PIX2
  Bottom 0.203: NEO_2A.2 50.79,14.7 57.12,14.7 58.95,16.53 NEO_2B.2 58.95,21.87 59.91,22.82 59.91,24.36 58.24,26.03 58.24,33.21 58.85,33.82 58.85,55.76 U$2.8
NEO_PIX3
  Bottom 0.203: NEO_3A.2 50.84,8.1 56.87,8.1 58.97,10.2 NEO_3B.2 58.97,15.63 59.92,16.58 59.92,17.38 59.91,17.39 59.91,20.8 61.91,22.79 61.91,24.14 58.64,27.4 58.64,32.99 59.26,33.61 59.26,60.43 U$2.10
POT1
  Top 0.203: U$2.A11 43.16,45.59 43.16,44.12 42.55,43.51 40.74,43.51 40.09,42.86 40.09,40.43 38.52,38.86 38.52,30.01 38.98,29.55 38.98,25.11 40.29,23.8 POT1.2
POT2
  Top 0.203: U$2.A10 44.17,44.55 42.72,43.1 40.91,43.1 40.5,42.69 40.5,40.26 38.93,38.69 38.93,30.18 39.41,29.7 39.41,25.29 40.29,24.4 40.69,24.4 41.18,23.91 41.18,23.84 41.2,23.82 41.2,22.66 40.05,21.51 40.05,17.17 POT2.2
SCL0  (via drill 0.3, 0.55)
  Top 0.203: U$2.19/A5 R11.1 | 65.59,31.81 65.89,31.52 65.89,22.32 | 65.59,31.81 62.37,35.04 60.91,35.04 60.52,35.43 56.39,35.43 v56.02,35.06 | I2C3.3 65.89,11.67 65.89,22.32 | v65.64,22.42 65.79,22.42 65.89,22.32 | v64.99,31.21 65.59,31.81
  Bottom 0.203: U$2.19/A5 44.39,52.17 45.18,51.38 45.18,48.12 45.73,47.57 45.73,41.33 48.98,38.08 51.78,38.08 53.98,35.88 55.2,35.88 v56.02,35.06 | I2C2.3 65.67,22.45 v65.64,22.42 | I2C1.3 64.99,32.14 v64.99,31.21
SDA0  (via drill 0.55)
  Top 0.203: U$2.18/A4 38.17,54.71 R10.1 | v56.02,36.26 56.44,35.84 60.69,35.84 61.08,35.45 62.53,35.45 64.36,33.62 | 64.36,33.62 66.3,31.69 66.3,24.49 | I2C3.2 66.3,13.26 66.3,24.49 | I2C2.2 66.34,24.45 66.3,24.49 | I2C1.2 64.47,33.62 64.36,33.62
  Bottom 0.203: U$2.18/A4 43.88,54.71 45.59,53.01 45.59,48.31 46.13,47.77 46.13,41.5 49.15,38.48 51.95,38.48 54.17,36.26 v56.02,36.26
SOL1  (via drill 0.38)
  Top 0.203: U$2.3 58.35,44.55 62.98,39.91 70.71,39.91 v71.46,40.66
  Bottom 0.203: R1.1 v71.46,40.66
SOL2  (via drill 0.38)
  Top 0.203: U$2.4 57.36,46.25 63.27,40.34 70.04,40.34 71.6,41.91 v71.64,41.91
  Bottom 0.203: R2.1 72.01,41.53 v71.64,41.91
SOL3  (via drill 0.38)
  Top 0.203: U$2.6 57.36,53.13 v61.09,56.87
  Bottom 0.203: R3.1 71.3,56.88 61.1,56.88 v61.09,56.87
SOL4
  Bottom 0.203: R4.1 59.99,68.87 59.27,67.41 U$2.12
SOL5
  Bottom 0.203: U$2.11 56.1,66.12 56.1,68.66 R5.1
SOL6
  Bottom 0.203: U$2.14/A0 41.56,64.87 39,67.43 39,70.48 R6.1
SOL7
  Bottom 0.203: U$2.15/A1 39.58,59.79 R7.1
SOL8
  Bottom 0.203: U$2.16/A2 42.07,59.84 40.2,59.84 39.75,59.38 33.01,59.38 29.41,55.78 R8.1
SOL9  (via drill 0.38)
  Top 0.203: U$2.7 53.04,54.71 52,55.76 44.05,55.76 43.57,55.28 43.57,51.47 42.79,50.69 41.65,50.69 38.46,47.49 38.46,45.44 37.48,44.47 v28.66,44.47
  Bottom 0.203: R9.1 26.81,44.47 v28.66,44.47

### Text on the board
tPlace: GND / PWR | GND / PWR | GND / PWR | GND / PWR | GND / PWR | GND / PWR | 3.3V | SDA | 3.3V | SIG | GND | SCL | GND | SIG | GND | GND | SIG | 5V | 5V | SIG | GND
bPlace: PWR / GND | GND / SIG
tNames: Lyre Genus / Mainboard v3.0 | 5V | GND | VIN | EN | 2020 | designed by / Nathan Villicana-Shaw
tValues: 10k | 10k | 4.7k | 4.7k | 10k | 10k | 0.1uf